# Altium schematic sheet POC-Potard.SchDoc
size A4
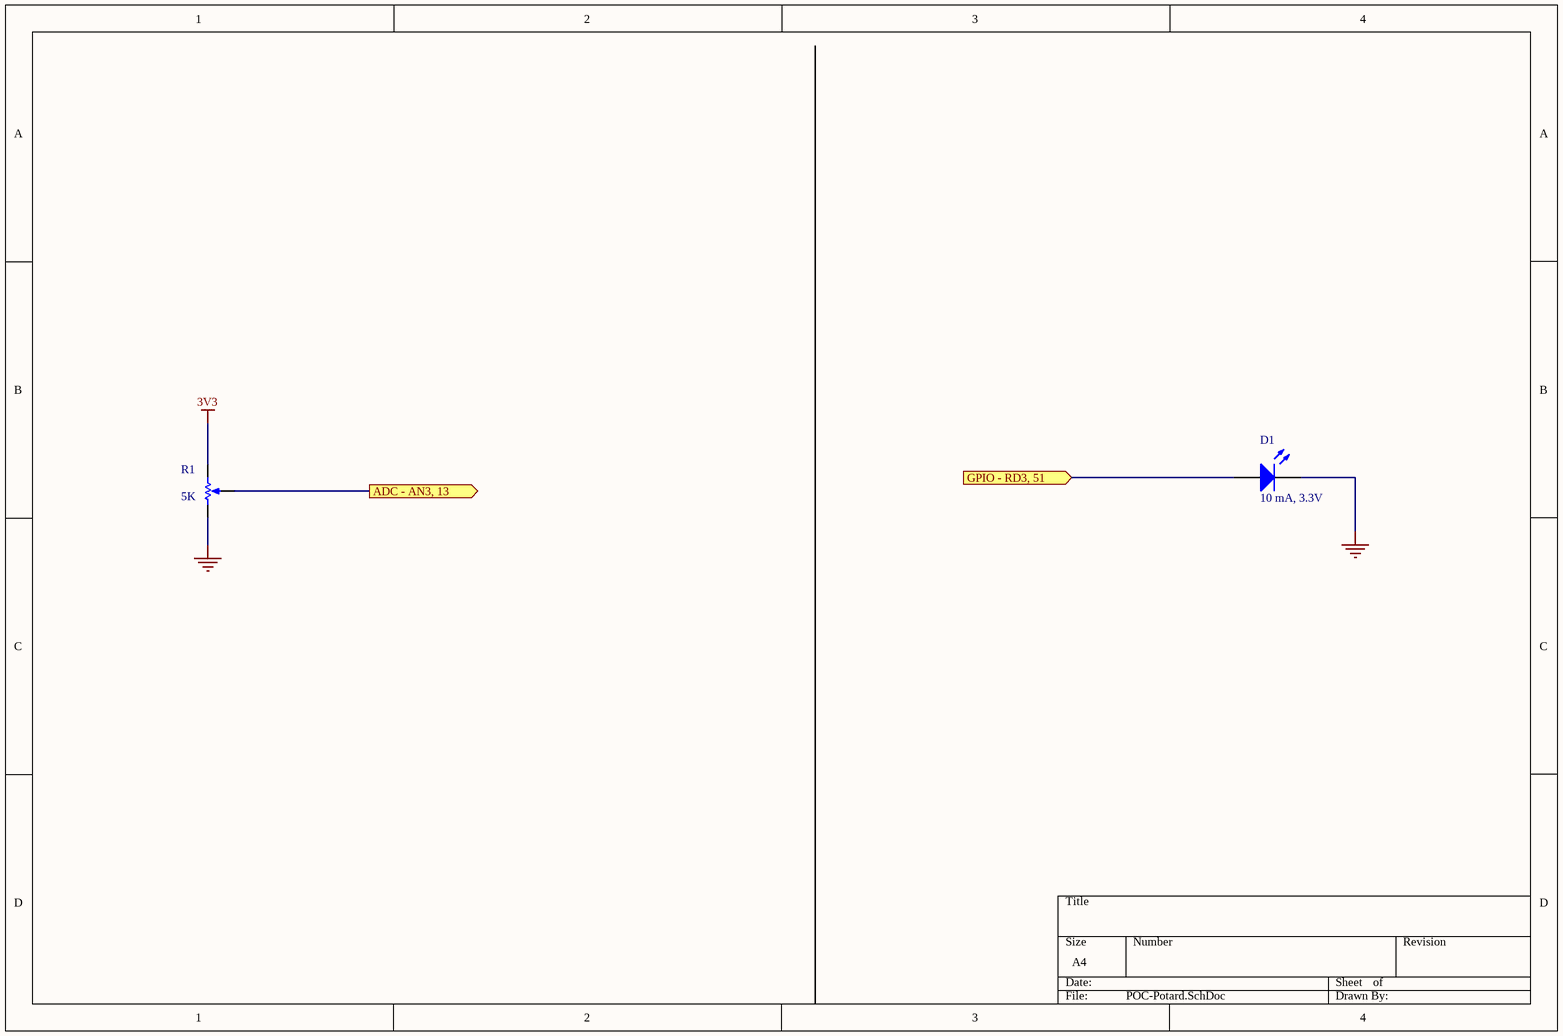
[diagram p0: POC-Potard.SchDoc]

## Parts
D1  10 mA, 3.3V  [3.5X2.8X1.9]
R1  5K  [VR5]

## Ports
ADC - AN3, 13 (out), GPIO - RD3, 51 (in)

## Nets
3V3: R1.2(BOT)
NetD1_2: D1.2(K) R1.1(TOP)
ADC - AN3, 13: R1.3(TAP) ; port ADC - AN3, 13
GPIO - RD3, 51: D1.1(A) ; port GPIO - RD3, 51

## Library data of the parts
D1 = LED3: Typical BLUE SiC LED; Amperage: 10 mA; Fournisseur: Farnell; RefFournisseur: 1200588; Fabricant: FORGE; RefFabricant: FNL-U500B23CDSL; Published: 8-Jun-2000; LatestRevisionDate: 17-Dec-2003; LatestRevisionNote: PCB Footprint replaced.; DatasheetVersion: 16-Apr-2002; PackageVersion: 16-Apr-2002; PackageReference: 3.5X2.8X1.9; Publisher: Altium Limited; PackageDescription: SM LED; 2 C-Bend Leads; Body 3.5 x 2.8 x 1.9 mm, inc leads (LxWxH typ); Voltage: 3.3V
R1 = RPot: Potentiometer; Sim Note: Enter the Resistance value and the set point into parameter fields.; Set Position: 0.5; Fournisseur: Farnell; Fabricant: BOURNS; RefFabricant: 91A1A-B28-B13L; RefFournisseur: 9357750; Published: 8-Jun-2000; LatestRevisionDate: 17-Jul-2002; LatestRevisionNote: Re-released for DXP Platform.; PackageReference: VR5; Publisher: Altium Limited; PackageDescription: Variable Resistor, Thru-Hole; 3 Leads; Value: 5K